# EAGLE design led-controller (EAGLE 6.4)
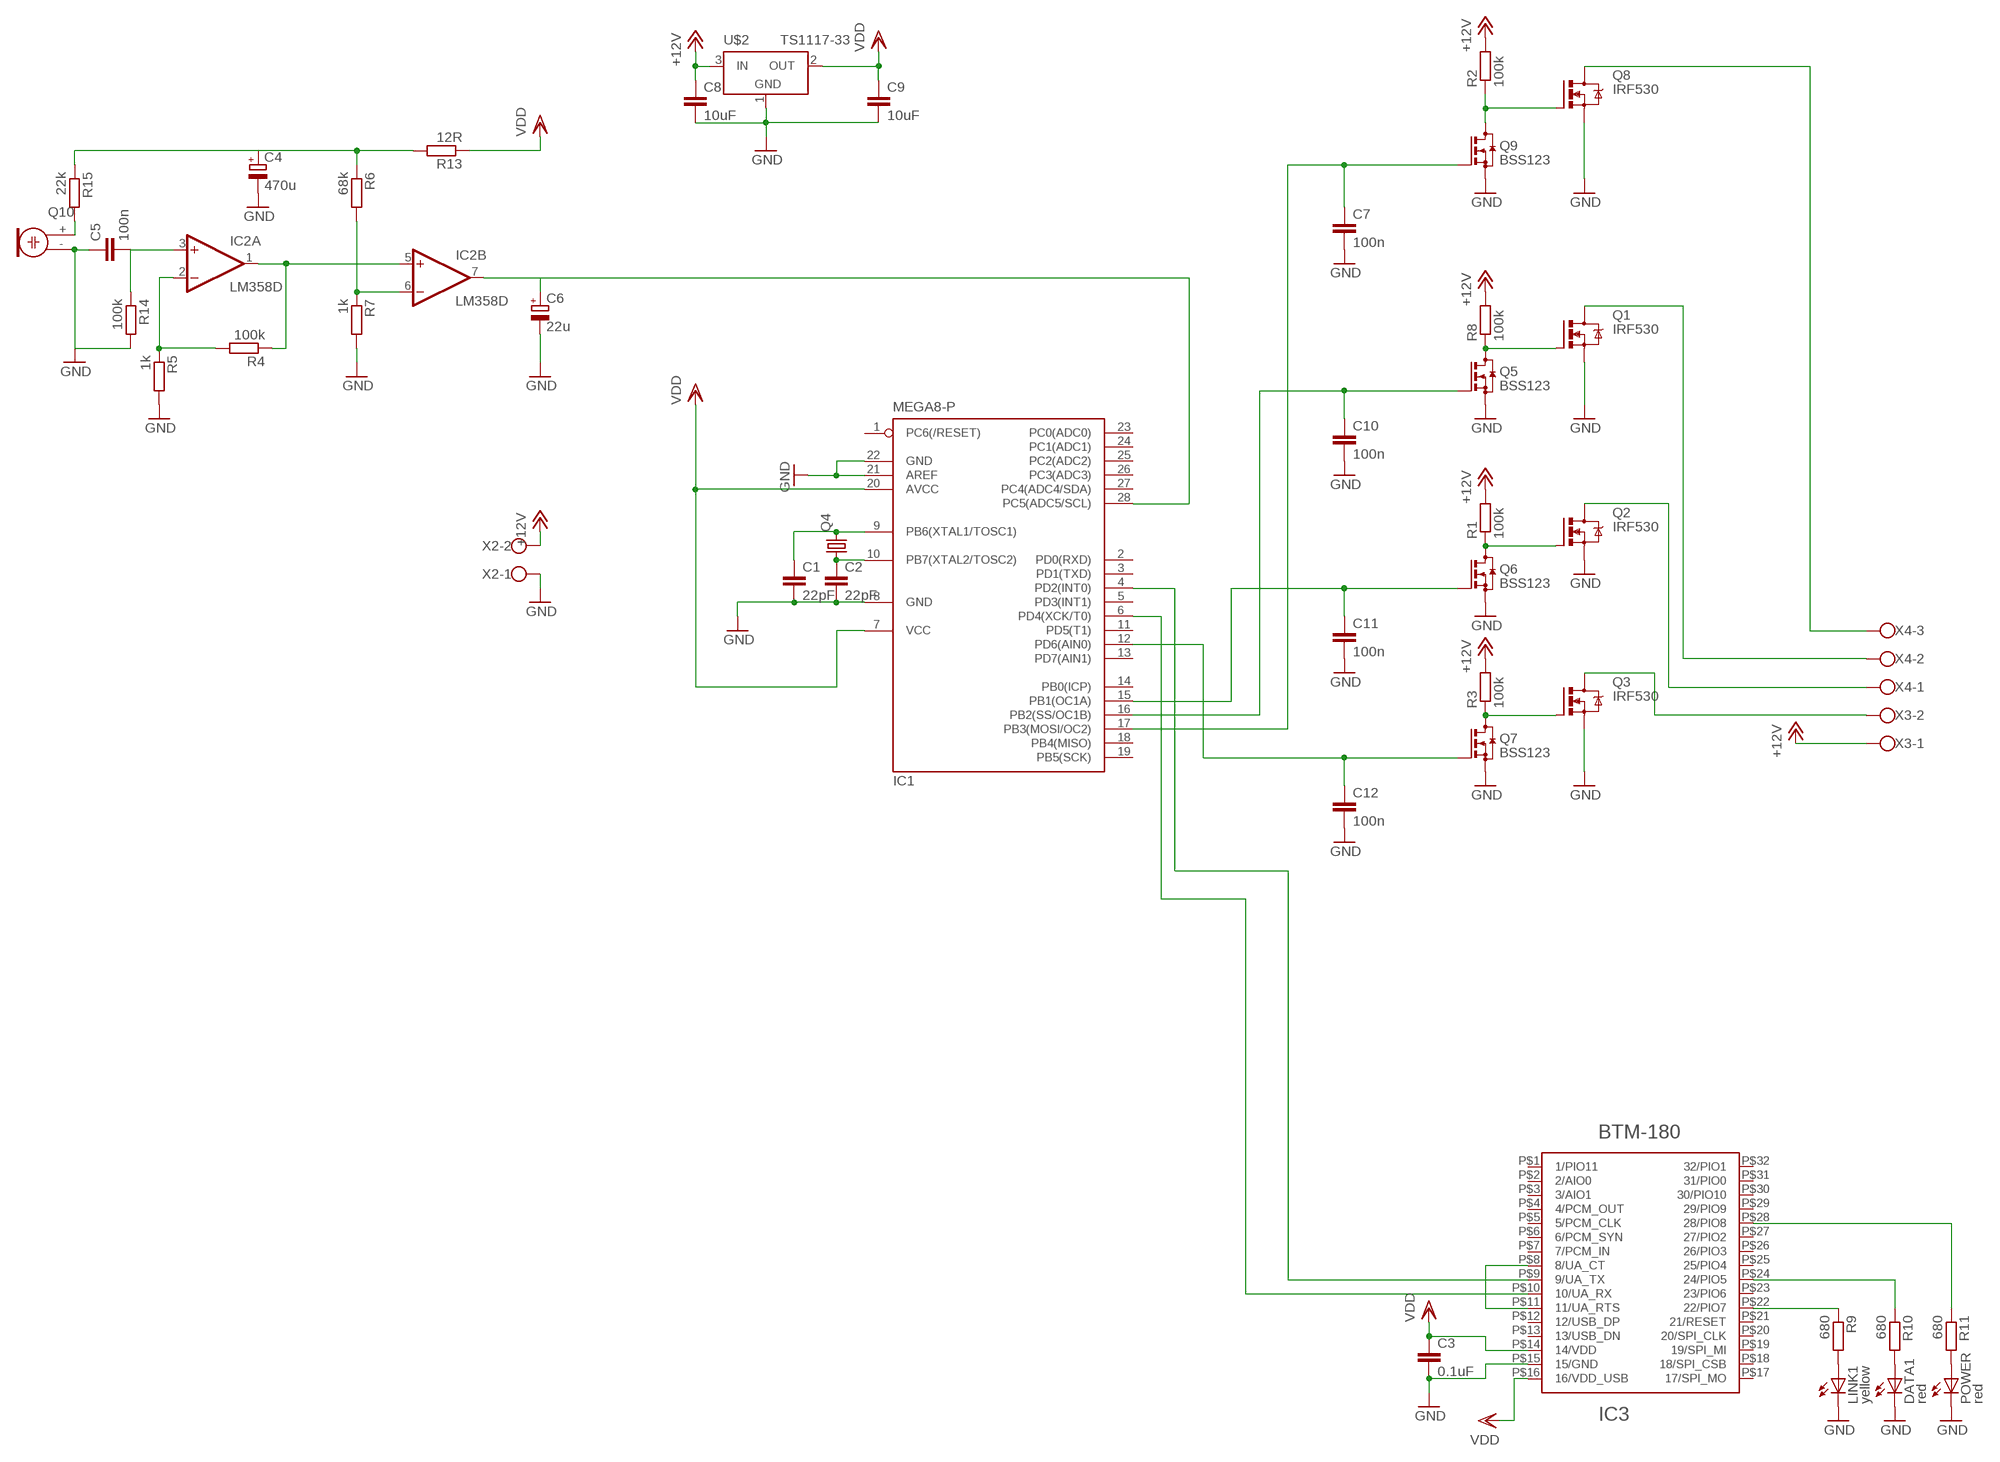
[diagram p0: schematic, sheet 1]

## Parts
C1  22pF  C-EUC0805K  [C0805K]
C2  22pF  C-EUC0805K  [C0805K]
C3  0.1uF  C-EUC0805K  [C0805K]
C4  470u  CPOL-EUE2-4  [E2-4]
C5  100n  C-EUC0805K  [C0805K]
C6  22u  CPOL-EUE2-4  [E2-4]
C7  100n  C-EUC0805K  [C0805K]
C8  10uF  C-EUC1206K  [C1206K]
C9  10uF  C-EUC1206K  [C1206K]
C10  100n  C-EUC0805K  [C0805K]
C11  100n  C-EUC0805K  [C0805K]
C12  100n  C-EUC0805K  [C0805K]
DATA1  red  LEDCHIPLED_0603  [CHIPLED_0603]
IC1  MEGA8-P  [DIL28-3]
IC2  LM358D  [SO08]
IC3  BTM-180  [BTM-180]
LINK1  yellow  LEDCHIPLED_0603  [CHIPLED_0603]
POWER  red  LEDCHIPLED_0603  [CHIPLED_0603]
Q1  IRF530  [TO220BV]
Q2  IRF530  [TO220BV]
Q3  IRF530  [TO220BV]
Q4  CRYSTALHC49S  [HC49/S]
Q5  BSS123  [SOT23]
Q6  BSS123  [SOT23]
Q7  BSS123  [SOT23]
Q8  IRF530  [TO220BV]
Q9  BSS123  [SOT23]
Q10  ELECTRET  [9.7ELECTRET]
R1  100k  R-EU_R0603  [R0603]
R2  100k  R-EU_R0603  [R0603]
R3  100k  R-EU_R0603  [R0603]
R4  100k  R-EU_R0603  [R0603]
R5  1k  R-EU_R0603  [R0603]
R6  68k  R-EU_R0603  [R0603]
R7  1k  R-EU_R0603  [R0603]
R8  100k  R-EU_R0603  [R0603]
R9  680  R-EU_R0603  [R0603]
R10  680  R-EU_R0603  [R0603]
R11  680  R-EU_R0603  [R0603]
R13  12R  R-EU_R0603  [R0603]
R14  100k  R-EU_R0603  [R0603]
R15  22k  R-EU_R0603  [R0603]
U$2  TS1117-33  TS1117-TO220  [TO220]
X2  W237-102  [W237-102]
X3  W237-102  [W237-102]
X4  W237-103  [W237-103]

## Nets
+12V: C8.1 R1.2 R2.2 R3.2 R8.2 U$2.3(IN) X2.2 X3.1
GND: C1.2 C2.2 C3.2 C4.- C5.1 C6.- C7.2 C8.2 C9.2 C10.2 C11.2 C12.2 DATA1.C IC1.8(GND) IC1.21(AREF) IC1.22(GND) IC3.P$15(15/GND) LINK1.C POWER.C Q1.S Q2.S Q3.S Q5.2(S) Q6.2(S) Q7.2(S) Q8.S Q9.2(S) Q10.- R5.2 R7.2 R14.2 U$2.1(GND) X2.1
N$1: IC2.1(A:OUT) IC2.5(B:+IN) R4.1
N$2: C1.1 IC1.9(PB6(XTAL1/TOSC1)) Q4.2
N$3: C2.1 IC1.10(PB7(XTAL2/TOSC2)) Q4.1
N$4: C11.1 IC1.15(PB1(OC1A)) Q6.1(G)
N$5: C10.1 IC1.16(PB2(SS/OC1B)) Q5.1(G)
N$6: C12.1 IC1.12(PD6(AIN0)) Q7.1(G)
N$7: Q1.G Q5.3(D) R8.1
N$8: Q2.G Q6.3(D) R1.1
N$9: Q3.G Q7.3(D) R3.1
N$10: C7.1 IC1.17(PB3(MOSI/OC2)) Q9.1(G)
N$11: IC2.6(B:-IN) R6.2 R7.1
N$12: Q8.G Q9.3(D) R2.1
N$13: IC2.2(A:-IN) R4.2 R5.1
N$14: C4.+ R6.1 R13.2 R15.1
N$15: Q10.+ R15.2
N$16: C5.2 IC2.3(A:+IN) R14.1
N$17: C6.+ IC1.28(PC5(ADC5/SCL)) IC2.7(B:OUT)
N$20: IC3.P$8(8/UA_CT) IC3.P$11(11/UA_RTS)
N$21: IC1.6(PD4(XCK/T0)) IC3.P$10(10/UA_RX)
N$22: IC1.4(PD2(INT0)) IC3.P$9(9/UA_TX)
N$23: POWER.A R11.2
N$24: DATA1.A R10.2
N$25: LINK1.A R9.2
N$28: IC3.P$22(22/PIO7) R9.1
N$29: IC3.P$24(24/PIO5) R10.1
N$30: IC3.P$28(28/PIO8) R11.1
OUT$BLUE [power]: Q3.D X3.2
OUT$BLUE1 [power]: Q8.D X4.3
OUT$GREEN [power]: Q2.D X4.1
OUT$RED [power]: Q1.D X4.2
VDD: C3.1 C9.1 IC1.7(VCC) IC1.20(AVCC) IC3.P$14(14/VDD) IC3.P$16(16/VDD_USB) R13.1 U$2.2(OUT)
Unconnected: IC1.1(PC6(/RESET)) IC1.2(PD0(RXD)) IC1.3(PD1(TXD)) IC1.5(PD3(INT1)) IC1.11(PD5(T1)) IC1.13(PD7(AIN1)) IC1.14(PB0(ICP)) IC1.18(PB4(MISO)) IC1.19(PB5(SCK)) IC1.23(PC0(ADC0)) IC1.24(PC1(ADC1)) IC1.25(PC2(ADC2)) IC1.26(PC3(ADC3)) IC1.27(PC4(ADC4/SDA)) IC3.P$1(1/PIO11) IC3.P$2(2/AIO0) IC3.P$3(3/AIO1) IC3.P$4(4/PCM_OUT) IC3.P$5(5/PCM_CLK) IC3.P$6(6/PCM_SYN) IC3.P$7(7/PCM_IN) IC3.P$12(12/USB_DP) IC3.P$13(13/USB_DN) IC3.P$17(17/SPI_MO) IC3.P$18(18/SPI_CSB) IC3.P$19(19/SPI_MI) IC3.P$20(20/SPI_CLK) IC3.P$21(21/RESET) IC3.P$23(23/PIO6) IC3.P$25(25/PIO4) IC3.P$26(26/PIO3) IC3.P$27(27/PIO2) IC3.P$29(29/PIO9) IC3.P$30(30/PIO10) IC3.P$31(31/PIO0) IC3.P$32(32/PIO1)

## Power pins joined to a net without a drawn wire
V+: IC2.8(P:V+)
V-: IC2.4(P:V-)

## Library data of the parts
C1-C3 C5 C7-C12 = rcl:C-EU: CAPACITOR, European symbol; OC_FARNELL: unknown
C4 C6 = rcl:CPOL-EU: POLARIZED CAPACITOR, European symbol
DATA1 = adafruit:LED: LED OSRAM: - CHIPLED LG R971, LG N971, LY N971, LG Q971, LY Q971, LO R971, LY R971 LH N974, LH R974 LS Q976, LO Q976, LY Q976 LO Q996 - Hyper CHIPLED LW Q18S LB Q993, LB Q99A, LB R99A - SideLED LS A670, LO A670, LY A670, LG A670, LP A670 LB A673, LV A673, LT A673, LW A673 LH A674 LY A675 LS A676, LA A676, LO A676, LY A676, LW A676 LS A679, LY A679, LG A679 - Hyper Micro SIDELED® LS Y876, LA Y876, LO Y876, LY Y876 LT Y87S - SmartLED LW L88C, LW L88S LB L89C, LB L89S, LG L890 LS L89K, LO L89K, LY L89K LS L896, LA L896, LO L896, LY L896 - TOPLED LS T670, LO T670, LY T670, LG T670, LP T670 LSG T670, LSP T670, LSY T670, LOP T670, LYG T670 LG T671, LOG T671, LSG T671 LB T673, LV T673, LT T673, LW T673 LH T674 LS T676, LA T676, LO T676, LY T676, LB T676, LH T676, LSB T676, LW T676 LB T67C, LV T67C, LT T67C, LS T67K, LO T67K, LY T67K, LW E67C LS E67B, LA E67B, LO E67B, LY E67B, LB E67C, LV E67C, LT E67C LW T67C LS T679, LY T679, LG T679 LS T770, LO T770, LY T770, LG T770, LP T770 LB T773, LV T773, LT T773, LW T773 LH T774 LS E675, LA E675, LY E675, LS T675 LS T776, LA T776, LO T776, LY T776, LB T776 LHGB T686 LT T68C, LB T68C - Hyper Mini TOPLED® LB M676 - Mini TOPLED Santana® LG M470 LS M47K, LO M47K, LY M47K Source: http://www.osram.convergy.de/; MF: AIM-TTI INSTRUMENTS; MPN: 037107; OC_FARNELL: 892890
IC1 = atmel:MEGA8-P: MICROCONTROLLER 8 Kbytes FLASH, 1 kbytes SRAM, 512 bytes EEPROM, USART, 4-channel 10 bit ADC, 2-channel 8 bit ADC Pin compatible with Atmega48, ATMega88, ATMega168 Source: avr.lbr; OC_FARNELL: unknown; OC_NEWARK: unknown
IC2 = linear:LM358: OP AMP also LM158; LM258; LM2904 Source: http://cache.national.com/ds/LM/LM158.pdf
IC3 = rayson__btm_bluetooth_modul:BTM-180: The module is a Max.4dBm( Class2 ) module with antenna Bluetooth standard Ver. 2.0 + EDR compliant. Low current consumption : Hold,Sniff,Park,Deep sleep Mode 3.0V or 1.8V operation Support for up to seven slaves : SCO links<3>,ACL links,Piconet<7> Interface: USB,UART&PCM(for voice CODEC) HCI or SPP,HSP/HFP,HID,DUN firmware is available Support for 802.11 Co-Exsitence RoHS compliant Small outline. 25.0 x 14.5 x 2.2 mm; OC_FARNELL: unknown
LINK1 POWER = adafruit:LED: LED OSRAM: - CHIPLED LG R971, LG N971, LY N971, LG Q971, LY Q971, LO R971, LY R971 LH N974, LH R974 LS Q976, LO Q976, LY Q976 LO Q996 - Hyper CHIPLED LW Q18S LB Q993, LB Q99A, LB R99A - SideLED LS A670, LO A670, LY A670, LG A670, LP A670 LB A673, LV A673, LT A673, LW A673 LH A674 LY A675 LS A676, LA A676, LO A676, LY A676, LW A676 LS A679, LY A679, LG A679 - Hyper Micro SIDELED® LS Y876, LA Y876, LO Y876, LY Y876 LT Y87S - SmartLED LW L88C, LW L88S LB L89C, LB L89S, LG L890 LS L89K, LO L89K, LY L89K LS L896, LA L896, LO L896, LY L896 - TOPLED LS T670, LO T670, LY T670, LG T670, LP T670 LSG T670, LSP T670, LSY T670, LOP T670, LYG T670 LG T671, LOG T671, LSG T671 LB T673, LV T673, LT T673, LW T673 LH T674 LS T676, LA T676, LO T676, LY T676, LB T676, LH T676, LSB T676, LW T676 LB T67C, LV T67C, LT T67C, LS T67K, LO T67K, LY T67K, LW E67C LS E67B, LA E67B, LO E67B, LY E67B, LB E67C, LV E67C, LT E67C LW T67C LS T679, LY T679, LG T679 LS T770, LO T770, LY T770, LG T770, LP T770 LB T773, LV T773, LT T773, LW T773 LH T774 LS E675, LA E675, LY E675, LS T675 LS T776, LA T776, LO T776, LY T776, LB T776 LHGB T686 LT T68C, LB T68C - Hyper Mini TOPLED® LB M676 - Mini TOPLED Santana® LG M470 LS M47K, LO M47K, LY M47K Source: http://www.osram.convergy.de/; OC_FARNELL: unknown
Q1-Q3 Q8 = transistor-power:IRF530: HEXFET Power MOSFET; OC_FARNELL: unknown
Q4 = crystal:CRYSTAL: CRYSTAL; OC_FARNELL: 1667008; OC_NEWARK: unknown
Q5-Q7 Q9 = transistor-small-signal:BSS123: N-CHANNEL MOS FET
Q10 = adafruit:ELECTRET: Electret microphone Thru hole 2.54mm spacing with 9.7mm diameter
R1-R11 R13-R15 = resistor:R-EU_: RESISTOR, European symbol; OC_FARNELL: unknown
U$2 = MeineLIB:TS1117; OC_FARNELL: unknown
X2 = con-wago-500:W237-102: WAGO SCREW CLAMP; OC_FARNELL: unknown; OC_NEWARK: 70K9898
X3 = con-wago-500:W237-102: WAGO SCREW CLAMP; MPN: 237-102; OC_FARNELL: unknown; OC_NEWARK: 70K9898
X4 = con-wago-500:W237-103: WAGO SCREW CLAMP; MPN: 237-103; OC_FARNELL: unknown; OC_NEWARK: 18M7116

## Net classes
0 default: width 0.305 mm, drill 0.508 mm, clearance 0.254 mm
1 power: width 0.762 mm, drill 1.016 mm, clearance 0.381 mm

## Board
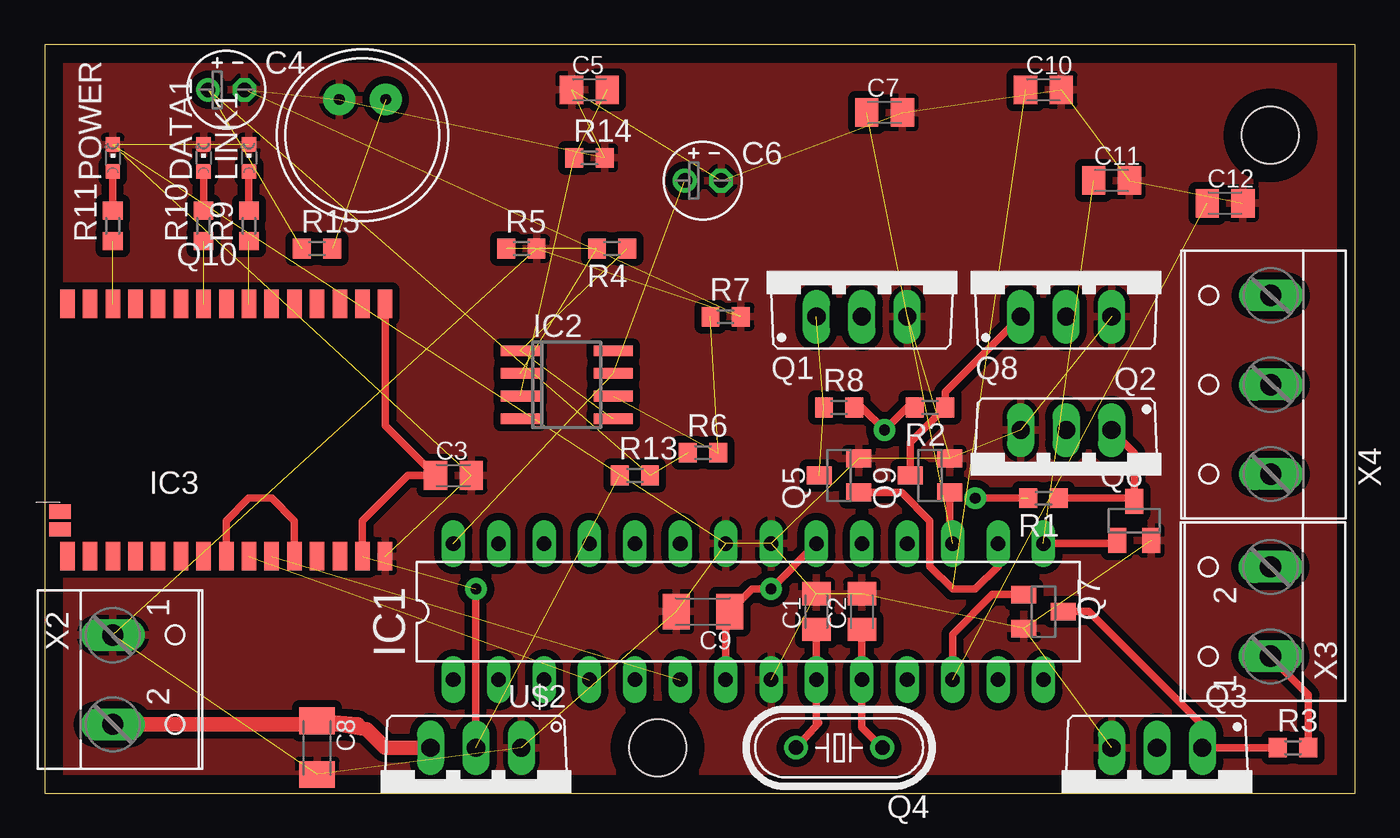
[diagram p1: board, top side]
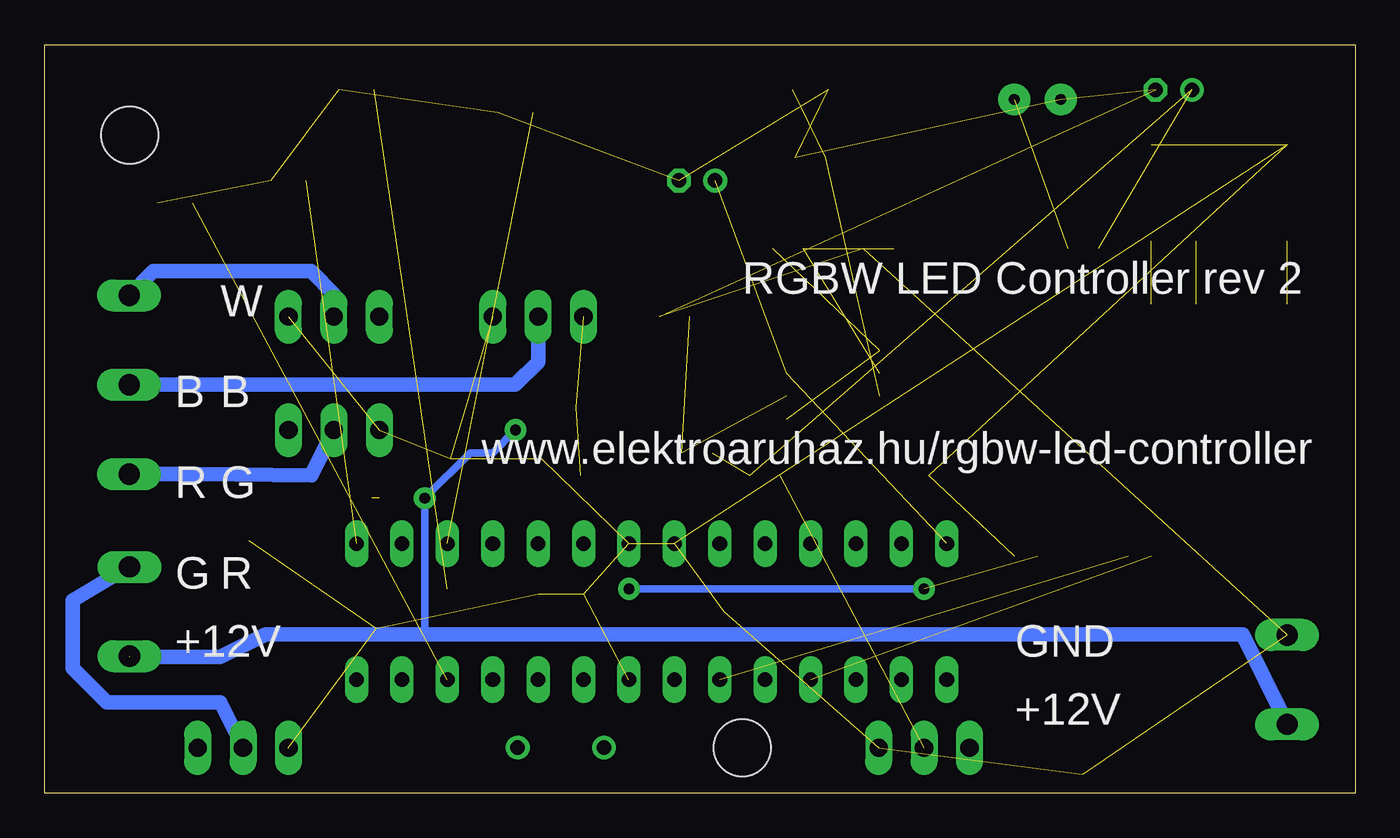
[diagram p2: board, bottom side, seen from below]

Size 73.33 x 41.9 mm. Coordinates in mm from the lower left corner, seen from the top.
Outline: 0,0 73.33,0 73.33,41.9 0,41.9 0,0
Copper layers (1*16): Top 0.035mm / dielectric 1.5mm / Bottom 0.035mm
Design rules "default *": minimum track width 10mil, minimum drill 24mil, track to track 8mil, track to pad 8mil, pad to pad 8mil, via to via 8mil, smd to smd 8mil, copper to edge 40mil, drill to drill 8mil, minimum pad ring 10mil, minimum via ring 12mil, stop-mask expansion 4mil, vias tented up to drill 0mil, thermal gap 10mil
Holes 3.2 mm at 34.29,2.54 68.58,36.83

### Footprints (pad centres in the part's own frame; a part is rotated, then mirrored left to right if it is on the bottom)
C0805K = smd 1.3 x 1.6: 1 -1,0; 2 1,0
E2-4 = drill 0.813 pad 1.27: + -1.016,0 | drill 0.813 pad 1.27 octagon: - 1.016,0
C1206K = smd 1.5 x 2: 1 -1.5,0; 2 1.5,0
CHIPLED_0603 = smd 0.8 x 0.8: A 0,-0.75; C 0,0.75
DIL28-3 = drill 0.813 long: 1 -16.51,-3.81; 2 -13.97,-3.81; 3 -11.43,-3.81; 4 -8.89,-3.81; 5 -6.35,-3.81; 6 -3.81,-3.81; 7 -1.27,-3.81; 8 1.27,-3.81; 9 3.81,-3.81; 10 6.35,-3.81; 11 8.89,-3.81; 12 11.43,-3.81; 13 13.97,-3.81; 14 16.51,-3.81; 15 16.51,3.81; 16 13.97,3.81; 17 11.43,3.81; 18 8.89,3.81; 19 6.35,3.81; 20 3.81,3.81; 21 1.27,3.81; 22 -1.27,3.81; 23 -3.81,3.81; 24 -6.35,3.81; 25 -8.89,3.81; 26 -11.43,3.81; 27 -13.97,3.81; 28 -16.51,3.81
SO08 = smd 0.6 x 2.2: 1 -1.905,-2.6; 2 -0.635,-2.6; 3 0.635,-2.6; 4 1.905,-2.6; 5 1.905,2.6; 6 0.635,2.6; 7 -0.635,2.6; 8 -1.905,2.6
BTM-180 = smd 0.81 x 1.6: P$1 -3.81,-7.06; P$2 -2.54,-7.06; P$3 -1.27,-7.06; P$4 0,-7.06; P$5 1.27,-7.06; P$6 2.54,-7.06; P$7 3.81,-7.06; P$8 5.08,-7.06; P$9 6.35,-7.06; P$10 7.62,-7.06; P$11 8.89,-7.06; P$12 10.16,-7.06; P$13 11.43,-7.06; P$14 12.7,-7.06; P$15 13.97,-7.06; P$16 13.97,7.06; P$17 12.7,7.06; P$18 11.43,7.06; P$19 10.16,7.06; P$20 8.89,7.06; P$21 7.62,7.06; P$22 6.35,7.06; P$23 5.08,7.06; P$24 3.81,7.06; P$25 2.54,7.06; P$26 1.27,7.06; P$27 0,7.06; P$28 -1.27,7.06; P$29 -2.54,7.06; P$30 -3.81,7.06 | smd 1.2 x 0.8: P$31 -4.22,-4.56; P$32 -4.22,-5.56
TO220BV = drill 1.016 long: D 0,-2.54; G -2.54,-2.54; S 2.54,-2.54
HC49/S = drill 0.813: 1 -2.413,0; 2 2.413,0
SOT23 = smd 1 x 1.4: 1 -0.95,-1.1; 2 0.95,-1.1; 3 0,1.1
9.7ELECTRET = drill 0.6 pad 1.778: + 1.3,2; - -1.3,2
R0603 = smd 1 x 1.1: 1 -0.85,0; 2 0.85,0
TO220 = drill 1.016 long: 1 -2.54,-2.54; 2 0,-2.54; 3 2.54,-2.54
W237-102 = drill 1.194 long: 1 -2.5,-1.27; 2 2.5,-1.27
W237-103 = drill 1.194 long: 1 -5,-1.29; 2 0,-1.29; 3 5,-1.29

### Placement (x,y rotation side)
C1  43.18,10.16 90 top
C2  45.72,10.16 90 top
C3  22.86,17.78 0 top
C4  10.16,39.37 0 top
C5  30.48,39.37 0 top
C6  36.83,34.29 0 top
C7  46.99,38.1 0 top
C8  15.24,2.54 270 top
C9  36.83,10.16 180 top
C10  55.88,39.37 0 top
C11  59.69,34.29 0 top
C12  66.04,33.02 0 top
DATA1  8.89,35.56 0 top
IC1  39.37,10.16 0 top
IC2  29.21,22.86 270 top
IC3  5.08,20.32 0 top
LINK1  11.43,35.56 0 top
POWER  3.81,35.56 0 top
Q1  45.72,29.21 0 top
Q2  57.15,17.78 180 top
Q3  62.23,0 180 top
Q4  44.45,2.54 180 top
Q5  44.45,17.78 90 top
Q6  60.96,15.24 0 top
Q7  55.88,10.16 270 top
Q8  57.15,29.21 0 top
Q9  49.53,17.78 90 top
Q10  17.78,36.83 0 top
R1  55.88,16.51 180 top
R2  49.53,21.59 180 top
R3  69.85,2.54 0 top
R4  31.75,30.48 180 top
R5  26.67,30.48 0 top
R6  36.83,19.05 0 top
R7  38.1,26.67 0 top
R8  44.45,21.59 0 top
R9  11.43,31.75 90 top
R10  8.89,31.75 90 top
R11  3.81,31.75 90 top
R13  33.02,17.78 0 top
R14  30.48,35.56 0 top
R15  15.24,30.48 0 top
U$2  24.13,0 180 top
X2  5.08,6.35 270 top
X3  67.31,10.16 90 top
X4  67.31,22.86 90 top

### Tracks (layer width: path | path; a pad name or v marks a point on that pad's centre or on a via)
+12V  (via drill 0.61)  (2 unrouted)
  Top 0.406: v52.07,16.51 54.61,16.51 | R3.2 70.7,5.5 68.58,7.62 | R8.2 45.72,21.59 v46.99,20.32 48.26,21.59 R2.2
  Top 0.813: U$2.3 19.05,2.54 18.01,3.58 C8.1 17.51,3.85 X2.2
  Bottom 0.406: 52.07,8.89 v52.07,16.51 49.53,19.05 48.26,19.05 v46.99,20.32
  Bottom 0.813: X3.1 68.54,7.62 63.5,7.62 60.96,8.89 52.07,8.89 6.31,8.89 X2.2
GND  (32 unrouted)
  pour Top (isolate 0.406): -1.27,43.18 73.66,43.18 73.66,-1.27 -1.27,-1.27
N$1  (2 unrouted)
N$2
  Top 0.406: Q4.2 43.31,3.94 43.18,3.81 IC1.9 C1.1
N$3
  Top 0.406: C2.1 IC1.10 45.72,3.68 Q4.1
N$4  (1 unrouted)
  Top 0.406: Q6.1 59.84,13.97 IC1.15
N$5  (1 unrouted)
  Top 0.406: IC1.16 53.34,12.7 52.07,11.43 50.8,11.43 49.53,12.7 49.53,15.24 47.94,16.83 Q5.1
N$6  (1 unrouted)
  Top 0.406: IC1.12 50.8,8.89 53.02,11.11 Q7.1
N$7  (2 unrouted)
N$8
  Top 0.406: Q2.G 60.96,19.05 Q6.3 60.79,16.51 R1.1
N$9
  Top 0.406: R3.1 Q3.G 64.77,3.81 58.42,10.16 Q7.3
N$10  (1 unrouted)
  Top 0.406: IC1.17 50.63,14.14 Q9.1
N$11  (2 unrouted)
N$12
  Top 0.406: Q9.3 48.43,19.64 R2.1 50.38,22.44 Q8.G
N$13  (2 unrouted)
N$14  (3 unrouted)
N$15  (1 unrouted)
N$16  (2 unrouted)
N$17  (2 unrouted)
N$20
  Top 0.406: IC3.P$8 10.16,15.24 11.43,16.51 12.7,16.51 13.97,15.24 IC3.P$11
N$21  (1 unrouted)
N$22  (1 unrouted)
N$23
  Top 0.406: R11.2 POWER.A
N$24
  Top 0.406: R10.2 DATA1.A
N$25
  Top 0.406: R9.2 LINK1.A
N$28  (1 unrouted)
N$29  (1 unrouted)
N$30  (1 unrouted)
OUT$BLUE
  Bottom 0.813: X3.2 68.62,12.66 71.75,10.79 71.75,6.99 69.85,5.08 63.5,5.08 Q3.D
OUT$BLUE1
  Bottom 0.813: Q8.D 57.15,27.94 58.42,29.21 67.25,29.21 X4.3
OUT$GREEN
  Bottom 0.813: X4.1 64.85,17.86 58.42,17.78 Q2.D
OUT$RED
  Bottom 0.813: Q1.D 45.72,24.13 46.99,22.86 X4.2
VDD  (via drill 0.61)  (2 unrouted)
  Top 0.406: U$2.2 v24.13,11.43 | IC1.20 v40.64,11.43 39.6,11.43 C9.1 38.1,9.93 IC1.7 | IC3.P$16 19.05,20.59 C3.1 20.32,17.78 17.78,15.24 IC3.P$14
  Bottom 0.406: v24.13,11.43 v40.64,11.43

### Text on the board
bPlace: RGBW LED Controller rev 2 | W | B | B | www.elektroaruhaz.hu/rgbw-led-controller | G | R | R | G | GND | +12V | +12V